# Altium schematic sheet analog.SchDoc
size A4
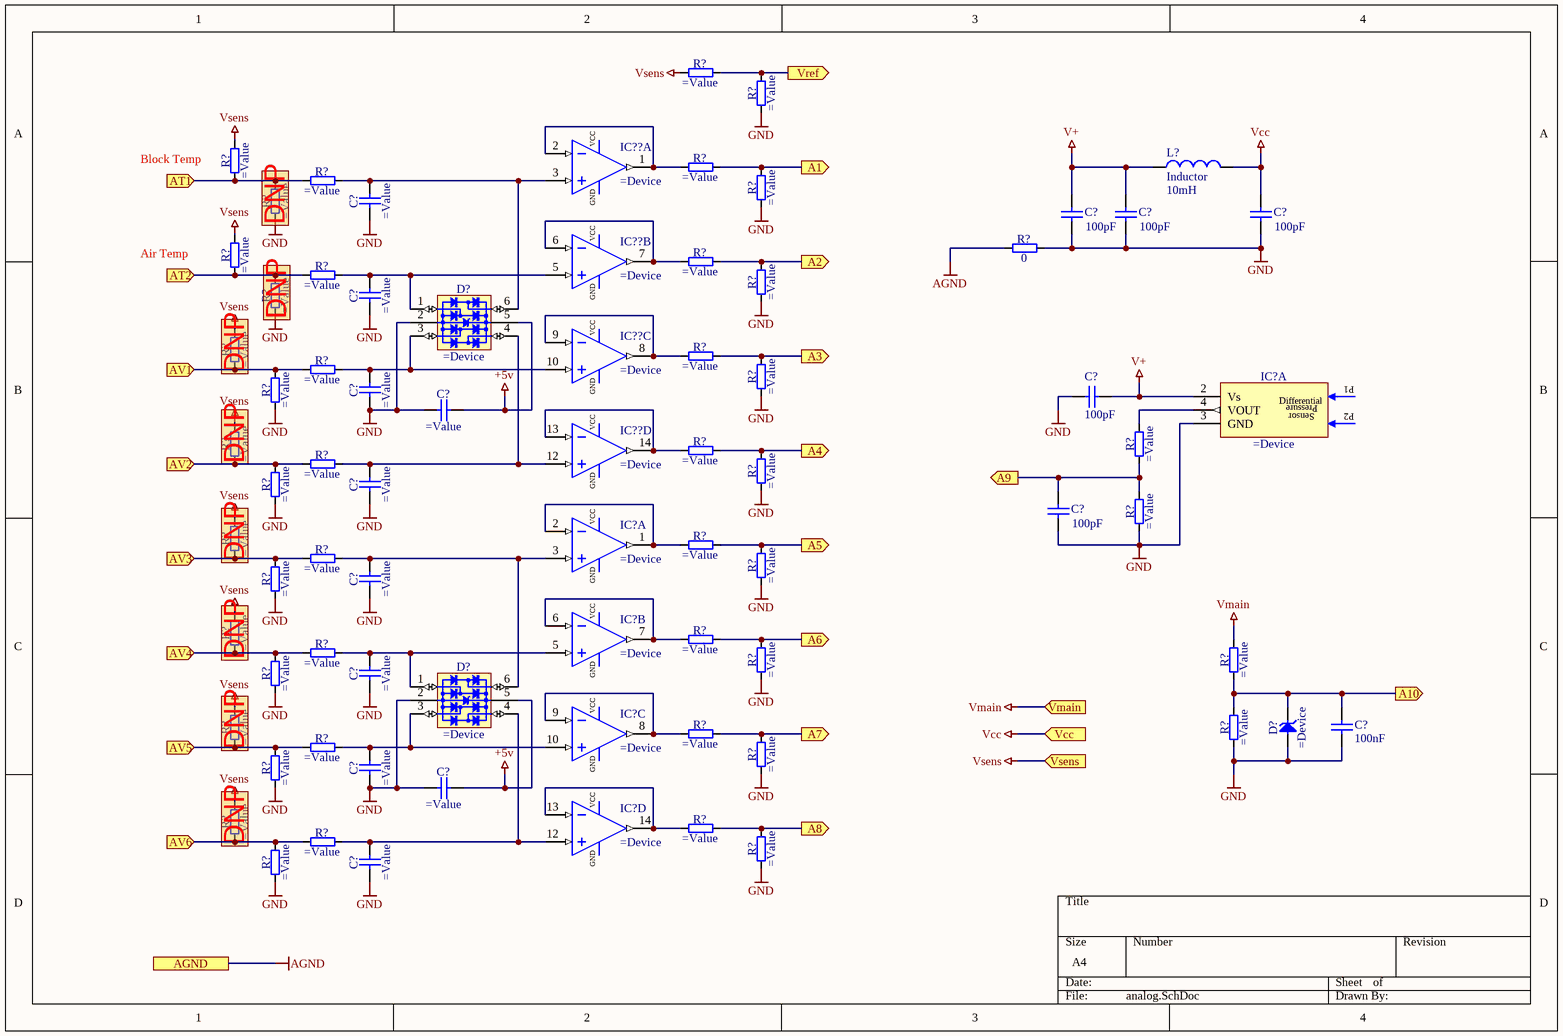
[diagram p0: analog.SchDoc]

## Parts
(Parts that share a designator on the sheet are numbered #1, #2 ... from top to bottom, then left to right.)
C?#1  (no value)
C?#2  value 100pF  [RAD-0.3]  (hidden comment: Cap)
C?#3  value 100pF  [RAD-0.3]  (hidden comment: Cap)
C?#4  value 100pF  [RAD-0.3]  (hidden comment: Cap)
C?#5  (no value)
C?#6  value 100pF  [RAD-0.3]  (hidden comment: Cap)
C?#7  (no value)
C?#8  (no value)
C?#9  (no value)
C?#10  value 100pF  [RAD-0.3]  (hidden comment: Cap)
C?#11  (no value)
C?#12  (no value)
C?#13  value 100nF  [RAD-0.3]  (hidden comment: Cap)
C?#14  (no value)
C?#15  (no value)
C?#16  (no value)
D?#1  (no value)
D?#2  (no value)
D?#3  (no value)
IC?#1  (no value)  (part A of 2)
IC?#2  (no value)  (part A of 4)
IC?#3  (no value)  (part B of 4)
IC?#4  (no value)  (part C of 4)
IC?#5  (no value)  (part D of 4)
IC??#1  (no value)  (part A of 4)
IC??#2  (no value)  (part B of 4)
IC??#3  (no value)  (part C of 4)
IC??#4  (no value)  (part D of 4)
L?  Inductor  value 10mH  [0402-A]
R?#1  (no value)
R?#2  (no value)
R?#3  (no value)
R?#4  (no value)
R?#5  (no value)
R?#6  (no value)
R?#7  (no value)
R?#8  0
R?#9  (no value)
R?#10  (no value)
R?#11  (no value)
R?#12  (no value)
R?#13  (no value)
R?#14  (no value)
R?#15  (no value)
R?#16  (no value)
R?#17  (no value)
R?#18  (no value)
R?#19  (no value)
R?#20  (no value)
R?#21  (no value)
R?#22  (no value)
R?#23  (no value)
R?#24  (no value)
R?#25  (no value)
R?#26  (no value)
R?#27  (no value)
R?#28  (no value)
R?#29  (no value)
R?#30  (no value)
R?#31  (no value)
R?#32  (no value)
R?#33  (no value)
R?#34  (no value)
R?#35  (no value)
R?#36  (no value)
R?#37  (no value)
R?#38  (no value)
R?#39  (no value)
R?#40  (no value)
R?#41  (no value)
R?#42  (no value)
R?#43  (no value)
R?#44  (no value)
R?#45  (no value)
R?#46  (no value)
R?#47  (no value)

## Ports
A1 (out), A2 (out), A3 (out), A4 (out), A5 (out), A6 (out), A7 (out), A8 (out), A9 (out), A10 (out), AGND, AT1 (in), AT2 (in), AV1 (in), AV2 (in), AV3 (in), AV4 (in), AV5 (in), AV6 (in), Vcc (in), Vmain (in), Vref (out), Vsens (in)

## Nets
+5v: C?#8.2 C?#15.2 D?#1.5(VBUS) D?#2.5(VBUS)
AGND: R?#8.1 ; port AGND
GND: C?#1.1 C?#2.1 C?#3.1 C?#4.1 C?#5.1 C?#6.1 C?#7.1 C?#8.1 C?#9.1 C?#10.1 C?#11.1 C?#12.1 C?#13.1 C?#14.1 C?#15.1 C?#16.1 D?#1.2(GND) D?#2.2(GND) D?#3.2(A) IC?#1.3(GND) R?#2.1 R?#6.1 R?#7.1 R?#8.2 R?#12.1 R?#13.1 R?#17.1 R?#18.1 R?#23.1 R?#24.1 R?#25.1 R?#29.1 R?#30.1 R?#34.1 R?#36.1 R?#40.1 R?#41.1 R?#42.1 R?#46.1 R?#47.1
V+: C?#2.2 C?#3.2 C?#6.2 IC?#1.2(Vs) L?.1
Vcc: C?#4.2 L?.2 ; port Vcc
Vmain: R?#35.2 ; port Vmain
Vsens: R?#1.1 R?#4.2 R?#10.2 R?#15.2 R?#20.2 R?#27.2 R?#32.2 R?#38.2 R?#44.2 ; port Vsens
A1: R?#3.2 R?#6.2 ; port A1
A2: R?#9.2 R?#12.2 ; port A2
A3: R?#14.2 R?#17.2 ; port A3
A4: R?#19.2 R?#23.2 ; port A4
A5: R?#26.2 R?#29.2 ; port A5
A6: R?#31.2 R?#34.2 ; port A6
A7: R?#37.2 R?#41.2 ; port A7
A8: R?#43.2 R?#46.2 ; port A8
A9: C?#10.2 R?#22.1 R?#25.2 ; port A9
A10: C?#13.2 D?#3.1(C) R?#35.1 R?#40.2 ; port A10
AT1: R?#4.1 R?#5.1 R?#7.2 ; port AT1
AT2: R?#10.1 R?#11.1 R?#13.2 ; port AT2
AV1: R?#15.1 R?#16.1 R?#18.2 ; port AV1
AV2: R?#20.1 R?#21.1 R?#24.2 ; port AV2
AV3: R?#27.1 R?#28.1 R?#30.2 ; port AV3
AV4: R?#32.1 R?#33.1 R?#36.2 ; port AV4
AV5: R?#38.1 R?#39.1 R?#42.2 ; port AV5
AV6: R?#44.1 R?#45.1 R?#47.2 ; port AV6
Vref: R?#1.2 R?#2.2 ; port Vref
NetC?#1_2: C?#1.2 D?#1.6(I/O4) IC??#1.3(IN+) R?#5.2
NetC?#5_2: C?#5.2 D?#1.1(I/O1) IC??#2.5(IN+) R?#11.2
NetC?#7_2: C?#7.2 D?#1.3(I/O2) IC??#3.10(IN+) R?#16.2
NetC?#9_2: C?#9.2 D?#1.4(I/O3) IC??#4.12(IN+) R?#21.2
NetC?#11_2: C?#11.2 D?#2.6(I/O4) IC?#2.3(IN+) R?#28.2
NetC?#12_2: C?#12.2 D?#2.1(I/O1) IC?#3.5(IN+) R?#33.2
NetC?#14_2: C?#14.2 D?#2.3(I/O2) IC?#4.10(IN+) R?#39.2
NetC?#16_2: C?#16.2 D?#2.4(I/O3) IC?#5.12(IN+) R?#45.2
NetIC?#1_4: IC?#1.4(VOUT) R?#22.2
NetIC?#2_1: IC?#2.1(OUT) IC?#2.2(IN-) R?#26.1
NetIC?#3_6: IC?#3.6(IN-) IC?#3.7(OUT) R?#31.1
NetIC?#4_8: IC?#4.8(OUT) IC?#4.9(IN-) R?#37.1
NetIC?#5_13: IC?#5.13(IN-) IC?#5.14(OUT) R?#43.1
NetIC??#1_1: IC??#1.1(OUT) IC??#1.2(IN-) R?#3.1
NetIC??#2_6: IC??#2.6(IN-) IC??#2.7(OUT) R?#9.1
NetIC??#3_8: IC??#3.8(OUT) IC??#3.9(IN-) R?#14.1
NetIC??#4_13: IC??#4.13(IN-) IC??#4.14(OUT) R?#19.1

Not connected (* = marked no-connect by the designer): IC?#2 4(V+) 11(GND); IC?#3 4(V+) 11(GND); IC?#4 4(V+) 11(GND); IC?#5 4(V+) 11(GND); IC??#1 4(V+) 11(GND); IC??#2 4(V+) 11(GND); IC??#3 4(V+) 11(GND); IC??#4 4(V+) 11(GND)

## Notes on the sheet
- (near R?#4) Block Temp
- (near R?#7) DNP
- (near R?#10) Air Temp
- (near R?#13) DNP
- (near R?#15) DNP
- (near R?#20) DNP
- (near R?#27) DNP
- (near R?#32) DNP
- (near R?#38) DNP
- (near R?#44) DNP
- (in symbol MP3V5004DP, part A) P1; Differential; Pressure; Sensor; P2
- (in symbol Operational Amplifier x4 Type4, part A) VCC
- (in symbol Operational Amplifier x4 Type4, part B) VCC
- (in symbol Operational Amplifier x4 Type4, part C) VCC
- (in symbol Operational Amplifier x4 Type4, part D) VCC

## Library data of the parts
C?#1 C?#5 C?#7-C?#9 C?#11 C?#12 C?#14-C?#16 = Capacitor - non polarized: Non-polarised capacitor
C?#2-C?#4 C?#6 C?#10 C?#13 = Cap: Capacitor; Published: 8-Jun-2000; LatestRevisionDate: 17-Jul-2002; LatestRevisionNote: Re-released for DXP Platform.; PackageReference: RAD-0.3; Publisher: Altium Limited; PackageDescription: Radial Cap, Thru-Hole; 2 Leads; 0.3 in Pin Spacing
D?#1 D?#2 = SRV05-4: RailClamps Low Capacitance TVS Diode Array
D?#3 = Diode Zener: Zener Diode
IC?#1 = MP3V5004DP: Integrated Silicon Pressure Sensor, On-Chip Signal Conditioned, Temperature Compensated and Calibrated
IC?#2-IC?#5 IC??#1-IC??#4 = Operational Amplifier x4 Type4: Quad Operational Amplifier
L? = Inductor: Code_IEC: 1005; Published: 8-Jun-2000; LatestRevisionDate: 29-May-2009; LatestRevisionNote: IPC-7351 Footprint Added.; PackageReference: 0402-A; Publisher: Altium Limited; PackageDescription: Chip Inductor; Code_JEITA: 0402
R?#1-R?#47 = Resistor
  R?#8: Value: 0